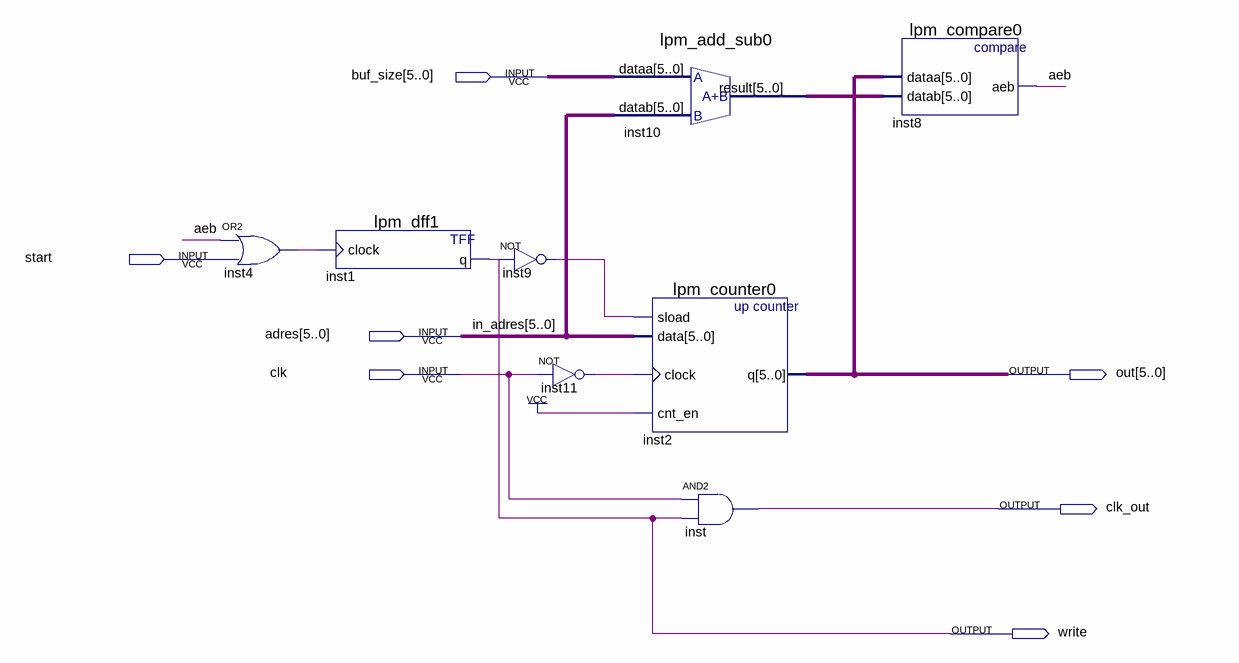
[diagram p0: schematic sheet]
// Quartus schematic write.bdf as structural Verilog: 8 symbols, 7 pins
module write (
  input  [5:0] buf_size,
  input  start,
  input  [5:0] adres,
  input  clk,
  output [5:0] out,
  output clk_out,
  output write
);

  wire aeb, inst4_out, inst9_out, inst11_out;
  wire [5:0] inst10_result;

  or inst4 (inst4_out, aeb, start);
  lpm_dff1 inst1 (.clock(inst4_out), .q(write));
  not inst9 (inst9_out, write);
  not inst11 (inst11_out, clk);
  lpm_add_sub0 inst10 (.dataa(buf_size), .datab(adres), .result(inst10_result));
  lpm_counter0 inst2 (.sload(inst9_out), .data(adres), .clock(inst11_out), .cnt_en(1'b1), .q(out));
  and inst (clk_out, clk, write);
  lpm_compare0 inst8 (.dataa(out), .datab(inst10_result), .aeb(aeb));

  // Other names for the same wires on the sheet: in_adres[5:0] = adres
endmodule
